# Altium schematic sheet badge.SchDoc
size A4
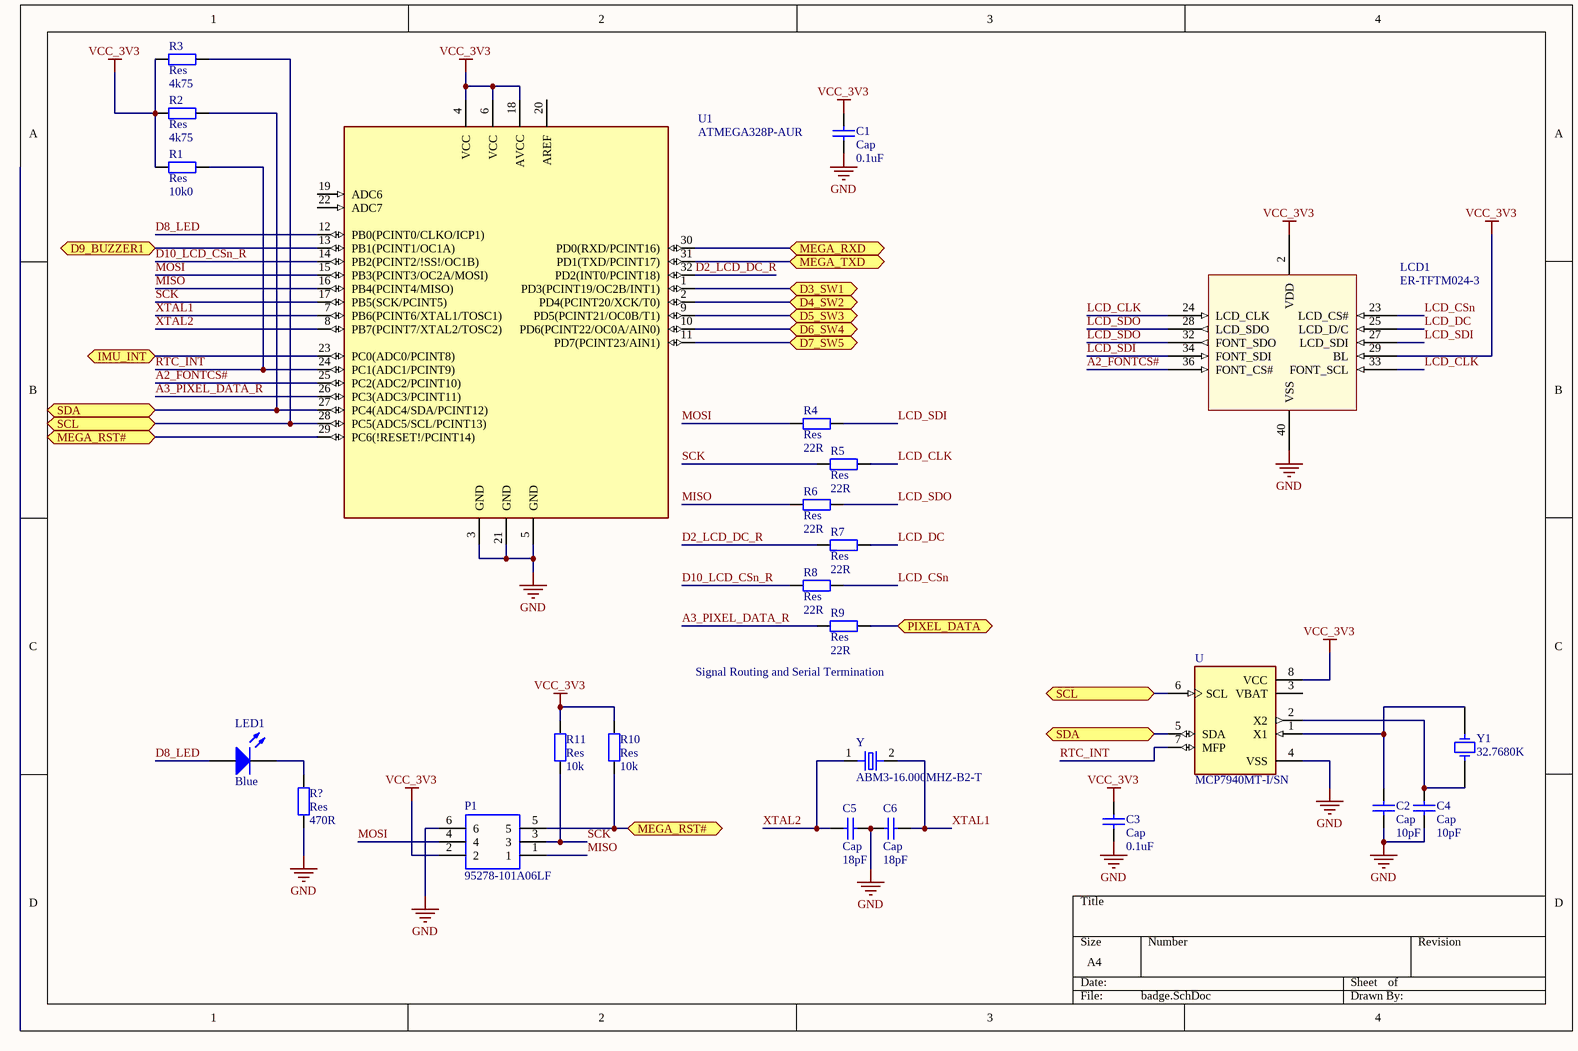
[diagram p0: badge.SchDoc]

## Parts
C1  Cap  value 0.1uF  [C0603]
C2  Cap  value 10pF  [C0603]
C3  Cap  value 0.1uF  [C0603]
C4  Cap  value 10pF  [C0603]
C5  Cap  value 18pF  [C0603]
C6  Cap  value 18pF  [C0603]
LCD1  ER-TFTM024-3  [ER-TFTM024-3]
LED1  Blue  [L0603]
P1  95278-101A06LF  [AMPHENOL_95278-101A06LF]
R1  Res  value 10k0  [R0603]
R2  Res  value 4k75  [R0603]
R3  Res  value 4k75  [R0603]
R4  Res  value 22R  [R0603]
R5  Res  value 22R  [R0603]
R6  Res  value 22R  [R0603]
R7  Res  value 22R  [R0603]
R8  Res  value 22R  [R0603]
R9  Res  value 22R  [R0603]
R10  Res  value 10k  [R0603]
R11  Res  value 10k  [R0603]
R?  Res  value 470R  [R0603]
U  MCP7940MT-I/SN  [SOIC127P600X175-8N]
U1  ATMEGA328P-AUR  [QFP80P900X900X120-32N]
Y  ABM3-16.000MHZ-B2-T  [XTAL500X320X130N]
Y1  32.7680K  [MC-405_32.7680K-D:_ROHS]

## Ports
D3_SW1 (bidir), D4_SW2 (bidir), D5_SW3 (bidir), D6_SW4 (bidir), D7_SW5 (bidir), D9_BUZZER1 (bidir), IMU_INT (bidir), MEGA_RST# (bidir), MEGA_RXD (bidir), MEGA_TXD (bidir), PIXEL_DATA (bidir), SCL (bidir), SDA (bidir)

## Nets
GND: C1.1 C2.1 C3.1 C4.1 C5.2 C6.1 LCD1.40(VSS) P1.6 R?.1 U.4(VSS) U1.3(GND) U1.5(GND) U1.21(GND)
VCC_3V3: C1.2 C3.2 LCD1.2(VDD) LCD1.29(BL) P1.2 R1.1 R2.1 R3.1 R10.2 R11.2 U.8(VCC) U1.4(VCC) U1.6(VCC) U1.18(AVCC)
A2_FONTCS#: LCD1.36(FONT_CS#) U1.25(PC2(ADC2/PCINT10))
A3_PIXEL_DATA_R: R9.1 U1.26(PC3(ADC3/PCINT11))
D2_LCD_DC_R: R7.1 U1.32(PD2(INT0/PCINT18))
D3_SW1: U1.1(PD3(PCINT19/OC2B/INT1)) ; port D3_SW1
D4_SW2: U1.2(PD4(PCINT20/XCK/T0)) ; port D4_SW2
D5_SW3: U1.9(PD5(PCINT21/OC0B/T1)) ; port D5_SW3
D6_SW4: U1.10(PD6(PCINT22/OC0A/AIN0)) ; port D6_SW4
D7_SW5: U1.11(PD7(PCINT23/AIN1)) ; port D7_SW5
D8_LED: LED1.1(A) U1.12(PB0(PCINT0/CLKO/ICP1))
D9_BUZZER1: U1.13(PB1(PCINT1/OC1A)) ; port D9_BUZZER1
D10_LCD_CSn_R: R8.1 U1.14(PB2(PCINT2/!SS!/OC1B))
IMU_INT: U1.23(PC0(ADC0/PCINT8)) ; port IMU_INT
LCD_CLK: LCD1.24(LCD_CLK) LCD1.33(FONT_SCL) R5.2
LCD_CSn: LCD1.23(LCD_CS#) R8.2
LCD_DC: LCD1.25(LCD_D/C) R7.2
LCD_SDI: LCD1.27(LCD_SDI) LCD1.34(FONT_SDI) R4.2
LCD_SDO: LCD1.28(LCD_SDO) LCD1.32(FONT_SDO) R6.2
MEGA_RST#: P1.5 R10.1 U1.29(PC6(!RESET!/PCINT14)) ; port MEGA_RST#
MEGA_RXD: U1.30(PD0(RXD/PCINT16)) ; port MEGA_RXD
MEGA_TXD: U1.31(PD1(TXD/PCINT17)) ; port MEGA_TXD
MISO: P1.1 R6.1 U1.16(PB4(PCINT4/MISO))
MOSI: P1.4 R4.1 U1.15(PB3(PCINT3/OC2A/MOSI))
PIXEL_DATA: R9.2 ; port PIXEL_DATA
RTC_INT: R1.2 U.7(MFP) U1.24(PC1(ADC1/PCINT9))
SCK: P1.3 R5.1 R11.1 U1.17(PB5(SCK/PCINT5))
SCL: R3.2 U.6(SCL) U1.28(PC5(ADC5/SCL/PCINT13)) ; port SCL
SDA: R2.2 U.5(SDA) U1.27(PC4(ADC4/SDA/PCINT12)) ; port SDA
XTAL1: C6.2 U1.7(PB6(PCINT6/XTAL1/TOSC1)) Y.2
XTAL2: C5.1 U1.8(PB7(PCINT7/XTAL2/TOSC2)) Y.1
NetC2_2: C2.2 U.1(X1) Y1.2
NetC4_2: C4.2 U.2(X2) Y1.1
NetLED1_2: LED1.2(K) R?.2

Not connected (* = marked no-connect by the designer): U 3(VBAT); U1 19(ADC6) 20(AREF) 22(ADC7)

## Notes on the sheet
- (near R9) Signal Routing and Serial Termination

## Library data of the parts
C1-C6 = Cap: Capacitor; Published: 8-Jun-2000; LatestRevisionDate: 17-Jul-2002; LatestRevisionNote: Re-released for DXP Platform.; PackageReference: RAD-0.3; Publisher: Altium Limited; PackageDescription: SMD Capacitor
LED1 = LED: Typical INFRARED GaAs LED; Published: 8-Jun-2000; LatestRevisionDate: 08-Jul-2005; LatestRevisionNote: Mech Layer 1 removed.; PackageReference: LED-0; Publisher: Altium Limited; PackageDescription: LED; 2 Leads
P1 = 95278-101A06LF: Connector Header Surface Mount 6 position 0.100 _2.54mm_; MF: Amphenol ICC; Package: None; Value: *; Price: None; MP: 95278-101A06LF; Availability: Unavailable; SnapEDA_Link: https://www.snapeda.com/parts/95278-101A06LF/Amphenol%20FCI/view-part/2763224/?ref=snap
R1-R11 R? = Res: Resistor; Published: 8-Jun-2000; LatestRevisionDate: 17-Jul-2002; LatestRevisionNote: Re-released for DXP Platform.; PackageReference: AXIAL-0.4; Publisher: Altium Limited
  R1-R9: PackageDescription: Axial Device, Thru-Hole; 2 Leads; 0.4 in Pin Spacing
  R10 R11 R?: PackageDescription: SMD Resistor
U = MCP7940MT-I/SN: Real Time Clock _RTC_ IC Clock/Calendar 64B IÂ²C, 2-Wire Serial 8-SOIC _0.154, 3.90mm Width_; MF: Microchip; Package: SO-8 Microchip; Value: *; SnapEDA_Link: https://www.snapeda.com/parts/MCP7940MT-I/SN/Microchip/view-part/1118394/?ref=snap; Price: None; MP: MCP7940MT-I/SN; Availability: Unavailable
U1 = ATMEGA328P-AUR: AVR AVRÂ® ATmega Microcontroller IC 8-Bit 20MHz 32KB _16K x 16_ FLASH 32-TQFP _7x7_; MF: Microchip; Package: TQFP-32 Microchip; Digi-Key_Part_Number: ATMEGA328P-AURCT-ND; Digi-Key_Purchase_URL: https://www.digikey.com/product-detail/en/microchip-technology/ATMEGA328P-AUR/ATMEGA328P-AURCT-ND/3789455?utm_source=snapeda&utm_medium=aggregator&utm_campaign=symbol; Value: *; MP: ATMEGA328P-AUR; SnapEDA_Link: https://www.snapeda.com/parts/ATMEGA328P-AUR/Microchip/view-part/1212624/?ref=snap
Y = ABM3-16.000MHZ-B2-T: 16MHz Â±20ppm Crystal 18pF 40 Ohms 2-SMD, No Lead; MF: Abracon; Value: *; MP: ABM3-16.000MHZ-B2-T; Package: SMD-2 Abracon; SnapEDA_Link: https://www.snapeda.com/parts/ABM3-16.000MHZ-B2-T/Abracon%20LLC/view-part/55266/?ref=snap; Digi-Key_Part_Number: 535-9103-1-ND; Digi-Key_Purchase_URL: https://www.digikey.com/product-detail/en/abracon-llc/ABM3-16.000MHZ-B2-T/535-9103-1-ND/675620?utm_source=snapeda&utm_medium=aggregator&utm_campaign=symbol
Y1 = MC-405_32.7680K-D:_ROHS: 32.768kHz Â±20ppm Crystal 35 kOhms 4-SOJ, 2.29mm pitch; MP: MC-405 32.7680K-D: ROHS; MF: EPSON; SnapEDA_Link: https://www.snapeda.com/parts/MC-405%2032.7680K-D:%20ROHS/EPSON/view-part/3612388/?ref=snap; Value: *; Package: 4-4 EPSON; Price: None; Availability: Unavailable